# EAGLE schematic mainBoard (EAGLE 6.4)

## Sheet 1 of 6: CPU
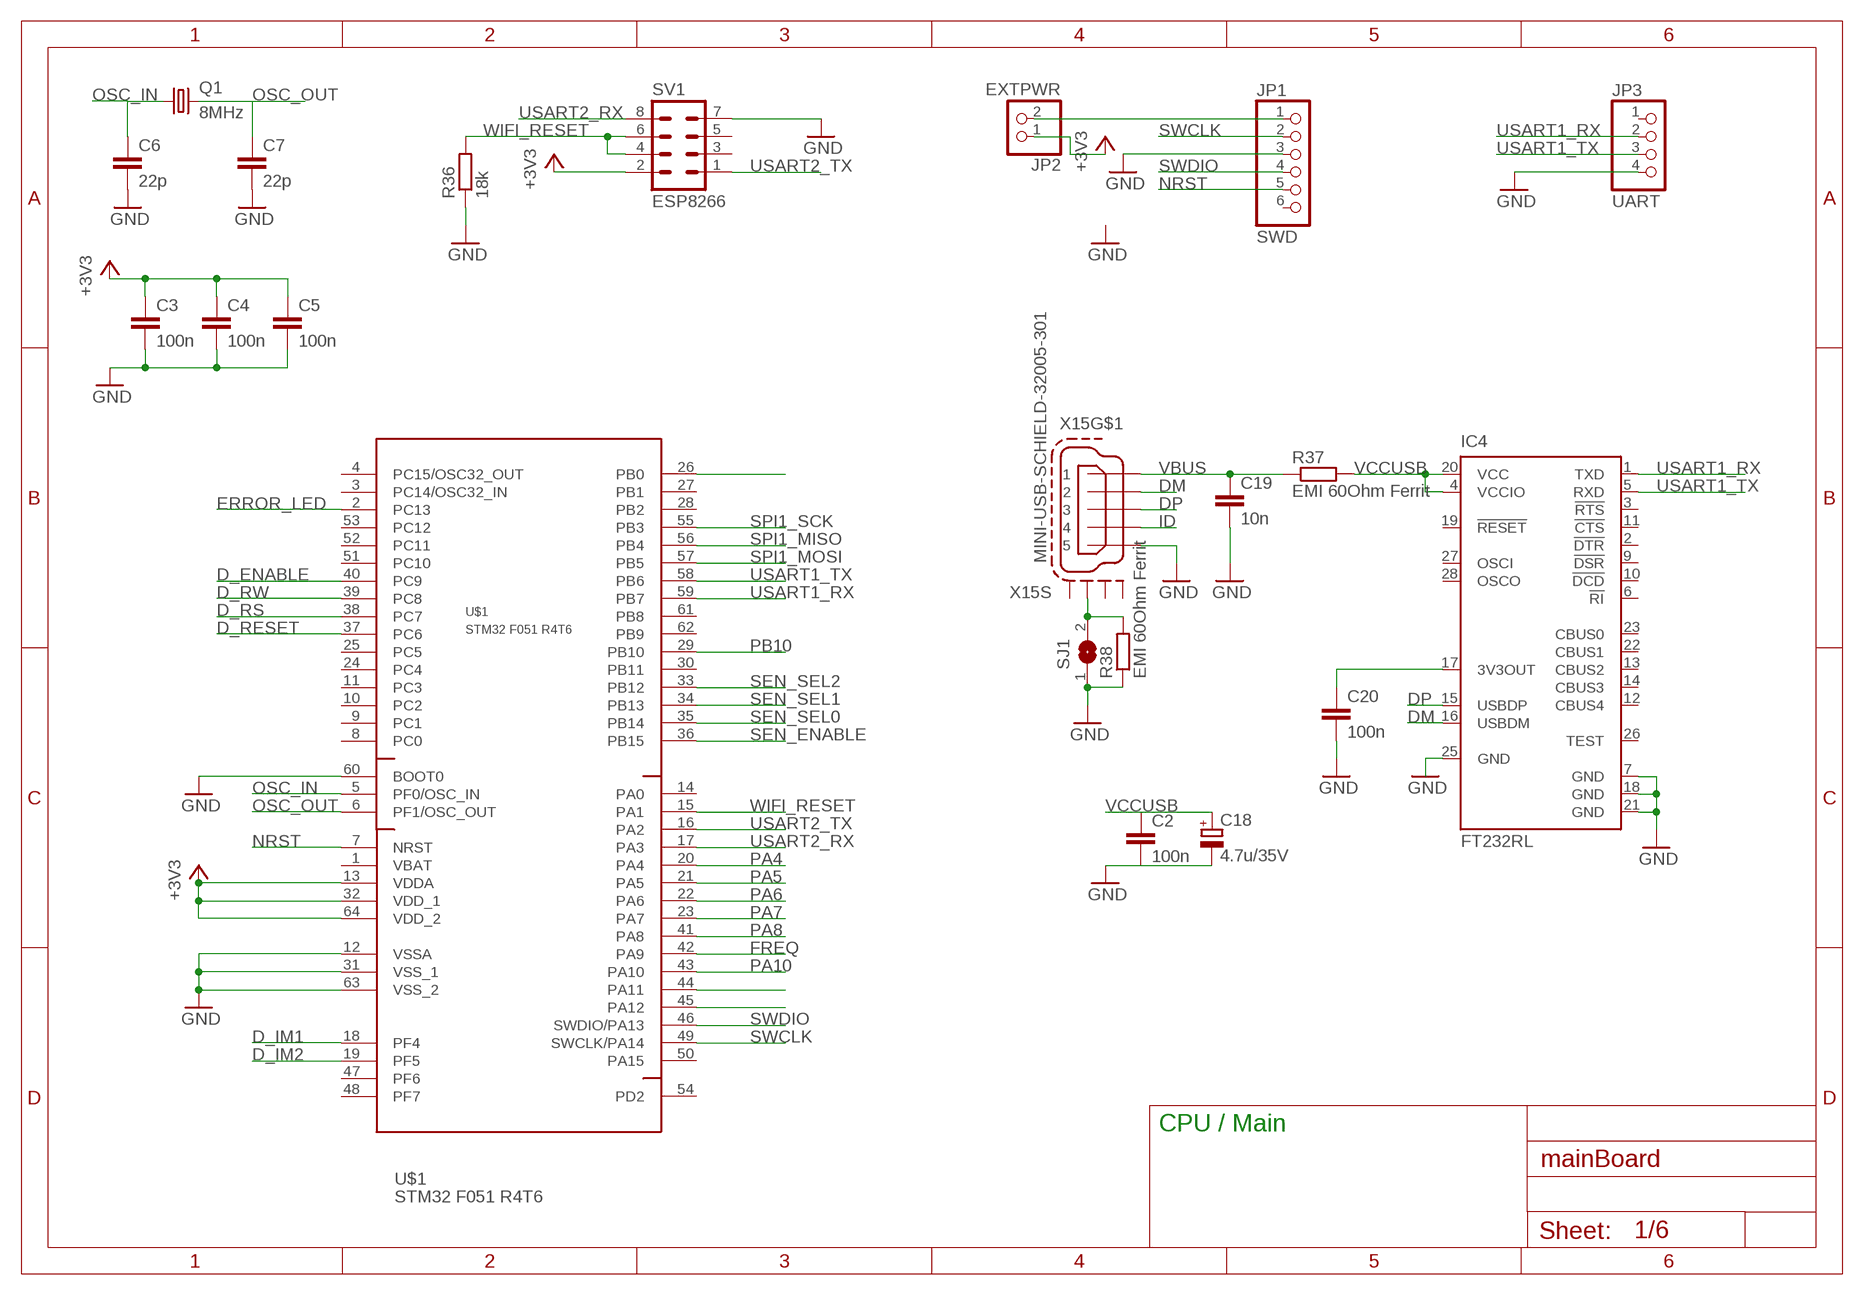
[diagram p0: schematic, sheet 1]

### Parts
C2  100n  C-EUC0603K  [C0603K]
C3  100n  C-EUC0603K  [C0603K]
C4  100n  C-EUC0603K  [C0603K]
C5  100n  C-EUC0603K  [C0603K]
C6  22p  C-EUC0805  [C0805]
C7  22p  C-EUC0805  [C0805]
C18  4.7u/35V  CPOL-EUB  [PANASONIC_B]
C19  10n  C-EUC0603K  [C0603K]
C20  100n  C-EUC0603K  [C0603K]
IC4  FT232RL  [SSOP28]
JP1  SWD  PINHD-1X6  [1X06]
JP2  EXTPWR  PINHD-1X2  [1X02]
JP3  UART  PINHD-1X4  [1X04]
Q1  8MHz  CRYSTALHC49UP  [HC49UP]
R36  18k  R-EU_R0805  [R0805]
R37  EMI 60Ohm Ferrit  R-EU_R0603  [R0603]
R38  EMI 60Ohm Ferrit  R-EU_R0603  [R0603]
SJ1  SJ  [SJ]
SV1  ESP8266  MA04-2  [MA04-2]
U$1  STM32 F051 R4T6  STM32F051  [LQFP64]
X15  MINI-USB-SCHIELD-32005-301  [32005-301]

### Nets
+3V3: C3.1 C4.1 C5.1 JP2.1 SV1.2 U$1.13(VDDA) U$1.32(VDD_1) U$1.64(VDD_2) ; also sheet 2,3,4
D_ENABLE: U$1.40(PC9) ; also sheet 4
D_IM1: U$1.18(PF4) ; also sheet 4
D_IM2: U$1.19(PF5) ; also sheet 4
D_RESET: U$1.37(PC6) ; also sheet 4
D_RS: U$1.38(PC7) ; also sheet 4
D_RW: U$1.39(PC8) ; also sheet 4
DM: IC4.16(USBDM) X15.2
DP: IC4.15(USBDP) X15.3
ERROR_LED: U$1.2(PC13) ; also sheet 4
FREQ: U$1.42(PA9) ; also sheet 3
GND: C2.2 C3.2 C4.2 C5.2 C6.2 C7.2 C18.- C19.2 C20.2 IC4.7(GND) IC4.18(GND) IC4.21(GND) IC4.25(GND) JP1.3 JP3.4 R36.1 R38.1 SJ1.1 SV1.7 U$1.12(VSSA) U$1.31(VSS_1) U$1.60(BOOT0) U$1.63(VSS_2) X15.5 ; also sheet 2,3,4,5
ID: X15.4
N$1: JP1.1 JP2.2
N$24: U$1.44(PA11)
N$25: U$1.45(PA12)
N$27: R38.2 SJ1.2 X15.M3(S:S3)
N$32: C20.1 IC4.17(3V3OUT)
NRST: JP1.5 U$1.7(NRST)
OSC_IN: C6.1 Q1.1 U$1.5(PF0/OSC_IN)
OSC_OUT: C7.1 Q1.2 U$1.6(PF1/OSC_OUT)
PA4: U$1.20(PA4) ; also sheet 5
PA5: U$1.21(PA5)
PA6: U$1.22(PA6) ; also sheet 5
PA7: U$1.23(PA7) ; also sheet 5
PA8: U$1.41(PA8) ; also sheet 5
PA10: U$1.43(PA10)
PB0: U$1.26(PB0) ; also sheet 5
PB10: U$1.29(PB10) ; also sheet 5
SEN_ENABLE: U$1.36(PB15) ; also sheet 3
SEN_SEL0: U$1.35(PB14) ; also sheet 3
SEN_SEL1: U$1.34(PB13) ; also sheet 3
SEN_SEL2: U$1.33(PB12) ; also sheet 3
SPI1_MISO: U$1.56(PB4) ; also sheet 4
SPI1_MOSI: U$1.57(PB5) ; also sheet 4
SPI1_SCK: U$1.55(PB3) ; also sheet 4
SWCLK: JP1.2 U$1.49(SWCLK/PA14)
SWDIO: JP1.4 U$1.46(SWDIO/PA13)
USART1_RX: IC4.1(TXD) JP3.2 U$1.59(PB7)
USART1_TX: IC4.5(RXD) JP3.3 U$1.58(PB6)
USART2_RX: SV1.8 U$1.17(PA3)
USART2_TX: SV1.1 U$1.16(PA2)
VBUS: C19.1 R37.1 X15.1
VCCUSB: C2.1 C18.+ IC4.4(VCCIO) IC4.20(VCC) R37.2
WIFI_RESET: R36.2 SV1.4 SV1.6 U$1.15(PA1)
Unconnected: IC4.2(!DTR) IC4.3(!RTS) IC4.6(!RI) IC4.9(!DSR) IC4.10(!DCD) IC4.11(!CTS) IC4.12(CBUS4) IC4.13(CBUS2) IC4.14(CBUS3) IC4.19(!RESET) IC4.22(CBUS1) IC4.23(CBUS0) IC4.26(TEST) IC4.27(OSCI) IC4.28(OSCO) JP1.6 JP3.1 SV1.3 SV1.5 U$1.3(PC14/OSC32_IN) U$1.4(PC15/OSC32_OUT) U$1.8(PC0) U$1.9(PC1) U$1.10(PC2) U$1.11(PC3) U$1.14(PA0) U$1.24(PC4) U$1.25(PC5) U$1.27(PB1) U$1.28(PB2) U$1.30(PB11) U$1.47(PF6) U$1.48(PF7) U$1.50(PA15) U$1.51(PC10) U$1.52(PC11) U$1.53(PC12) U$1.54(PD2) U$1.61(PB8) U$1.62(PB9) X15.M1(S:S1) X15.M2(S:S2) X15.M4(S:S4)

### Notes on the sheet
- CPU / Main

## Sheet 2 of 6: PowerSupply
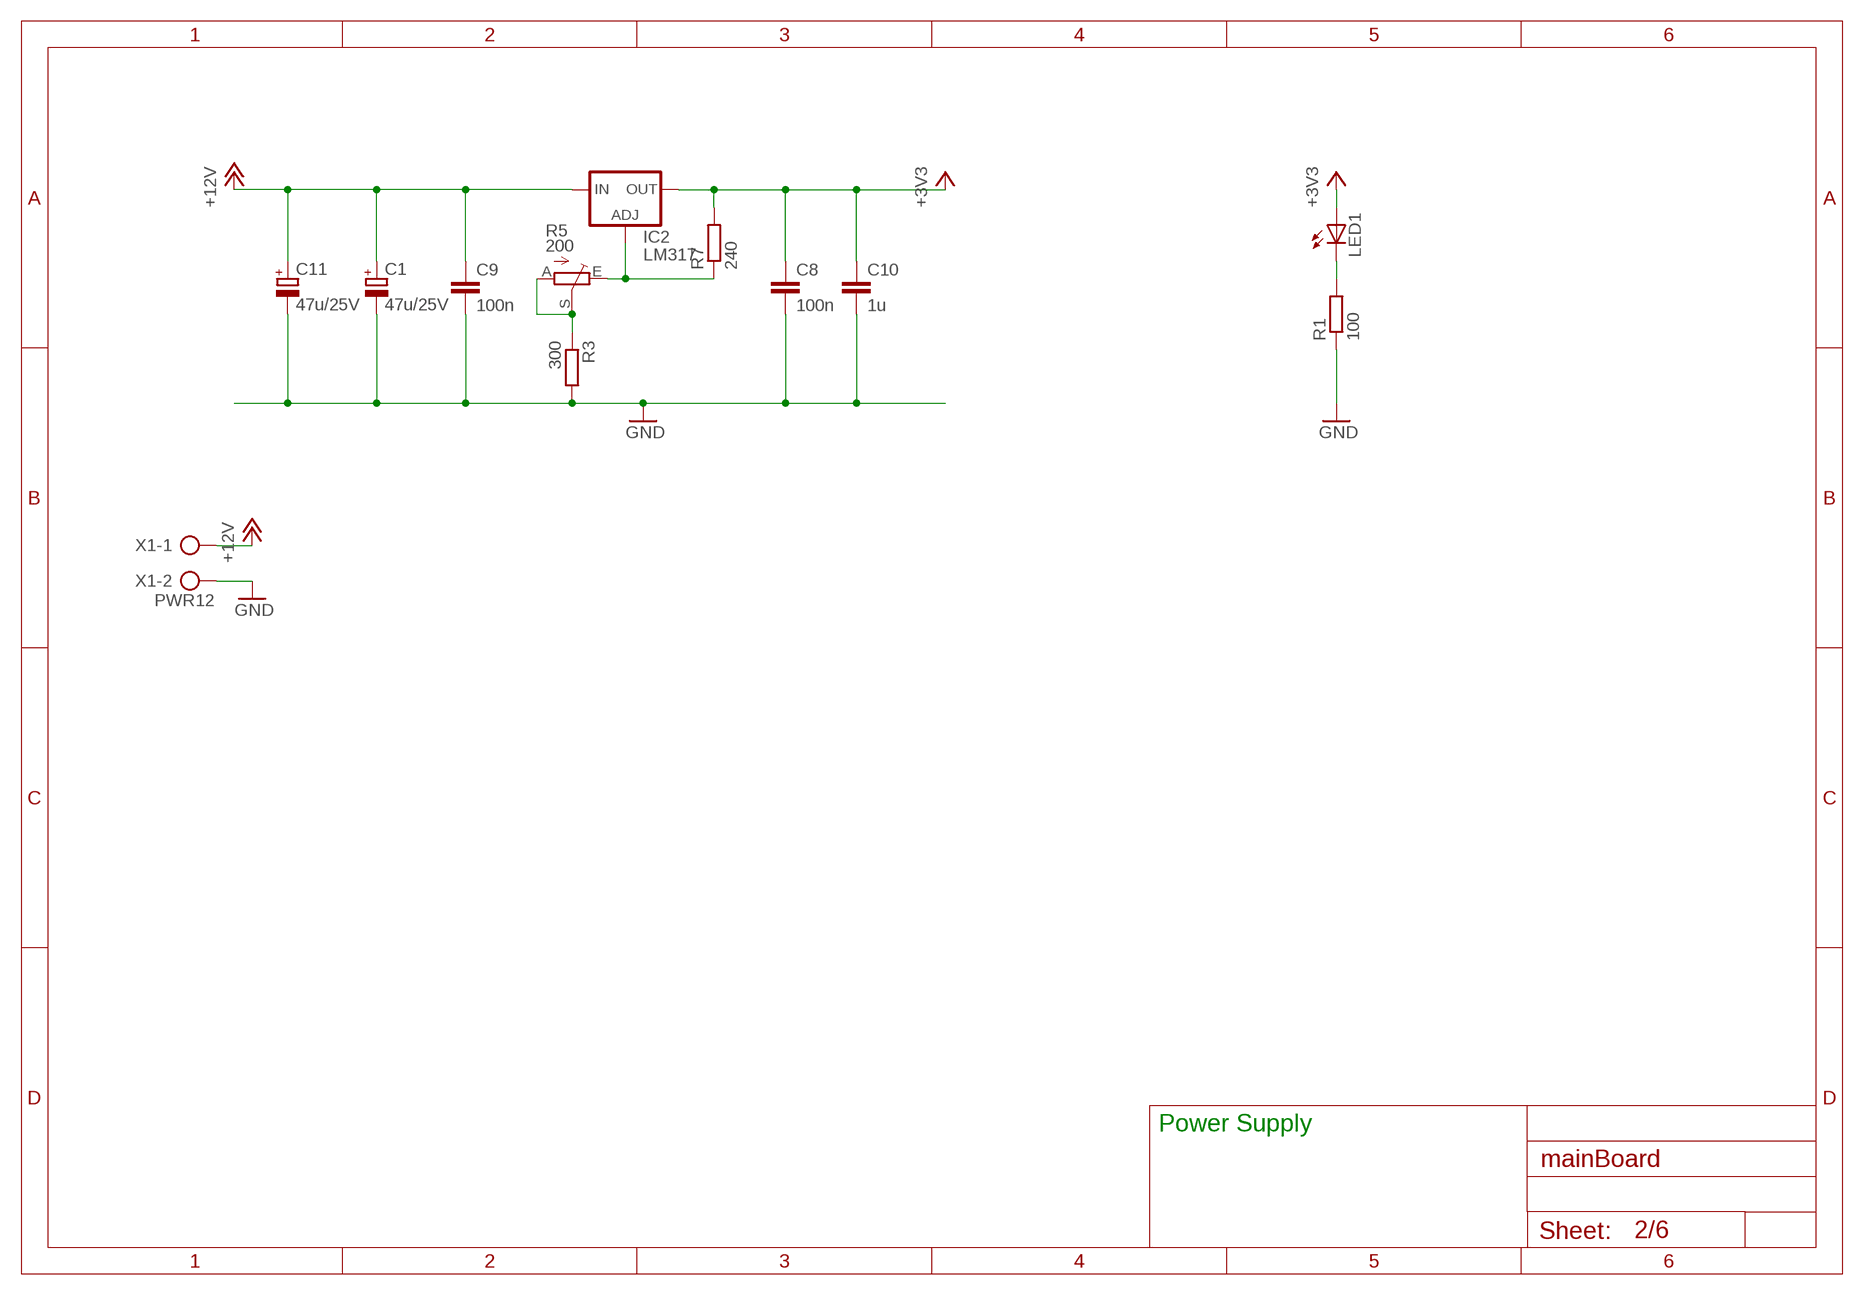
[diagram p1: schematic, sheet 2]

### Parts
C1  47u/25V  CPOL-EUD  [PANASONIC_D]
C8  100n  C-EUC0805  [C0805]
C9  100n  C-EUC0805  [C0805]
C10  1u  C-EUC0805  [C0805]
C11  47u/25V  CPOL-EUD  [PANASONIC_D]
IC2  LM317  LM317MBSTT3  [SOT223]
LED1  LEDCHIP-LED0805  [CHIP-LED0805]
R1  100  R-EU_R0805  [R0805]
R3  300  R-EU_R0805  [R0805]
R5  200  TRIM_EU-S64Y  [S64Y]
R7  240  R-EU_R0805  [R0805]
X1  PWR12  AK500/2  [AK500/2]

### Nets
+3V3: C8.1 C10.1 IC2.4(OUT) LED1.A R7.2 ; also sheet 1,3,4
+12V: C1.+ C9.1 C11.+ IC2.3(IN) X1.1 ; also sheet 5
GND: C1.- C8.2 C9.2 C10.2 C11.- R1.1 R3.2 X1.2 ; also sheet 1,3,4,5
N$9: LED1.C R1.2
N$12: R3.1 R5.A R5.S
N$20: IC2.1(ADJ) R5.E R7.1

### Notes on the sheet
- Power Supply

## Sheet 3 of 6: Sensors
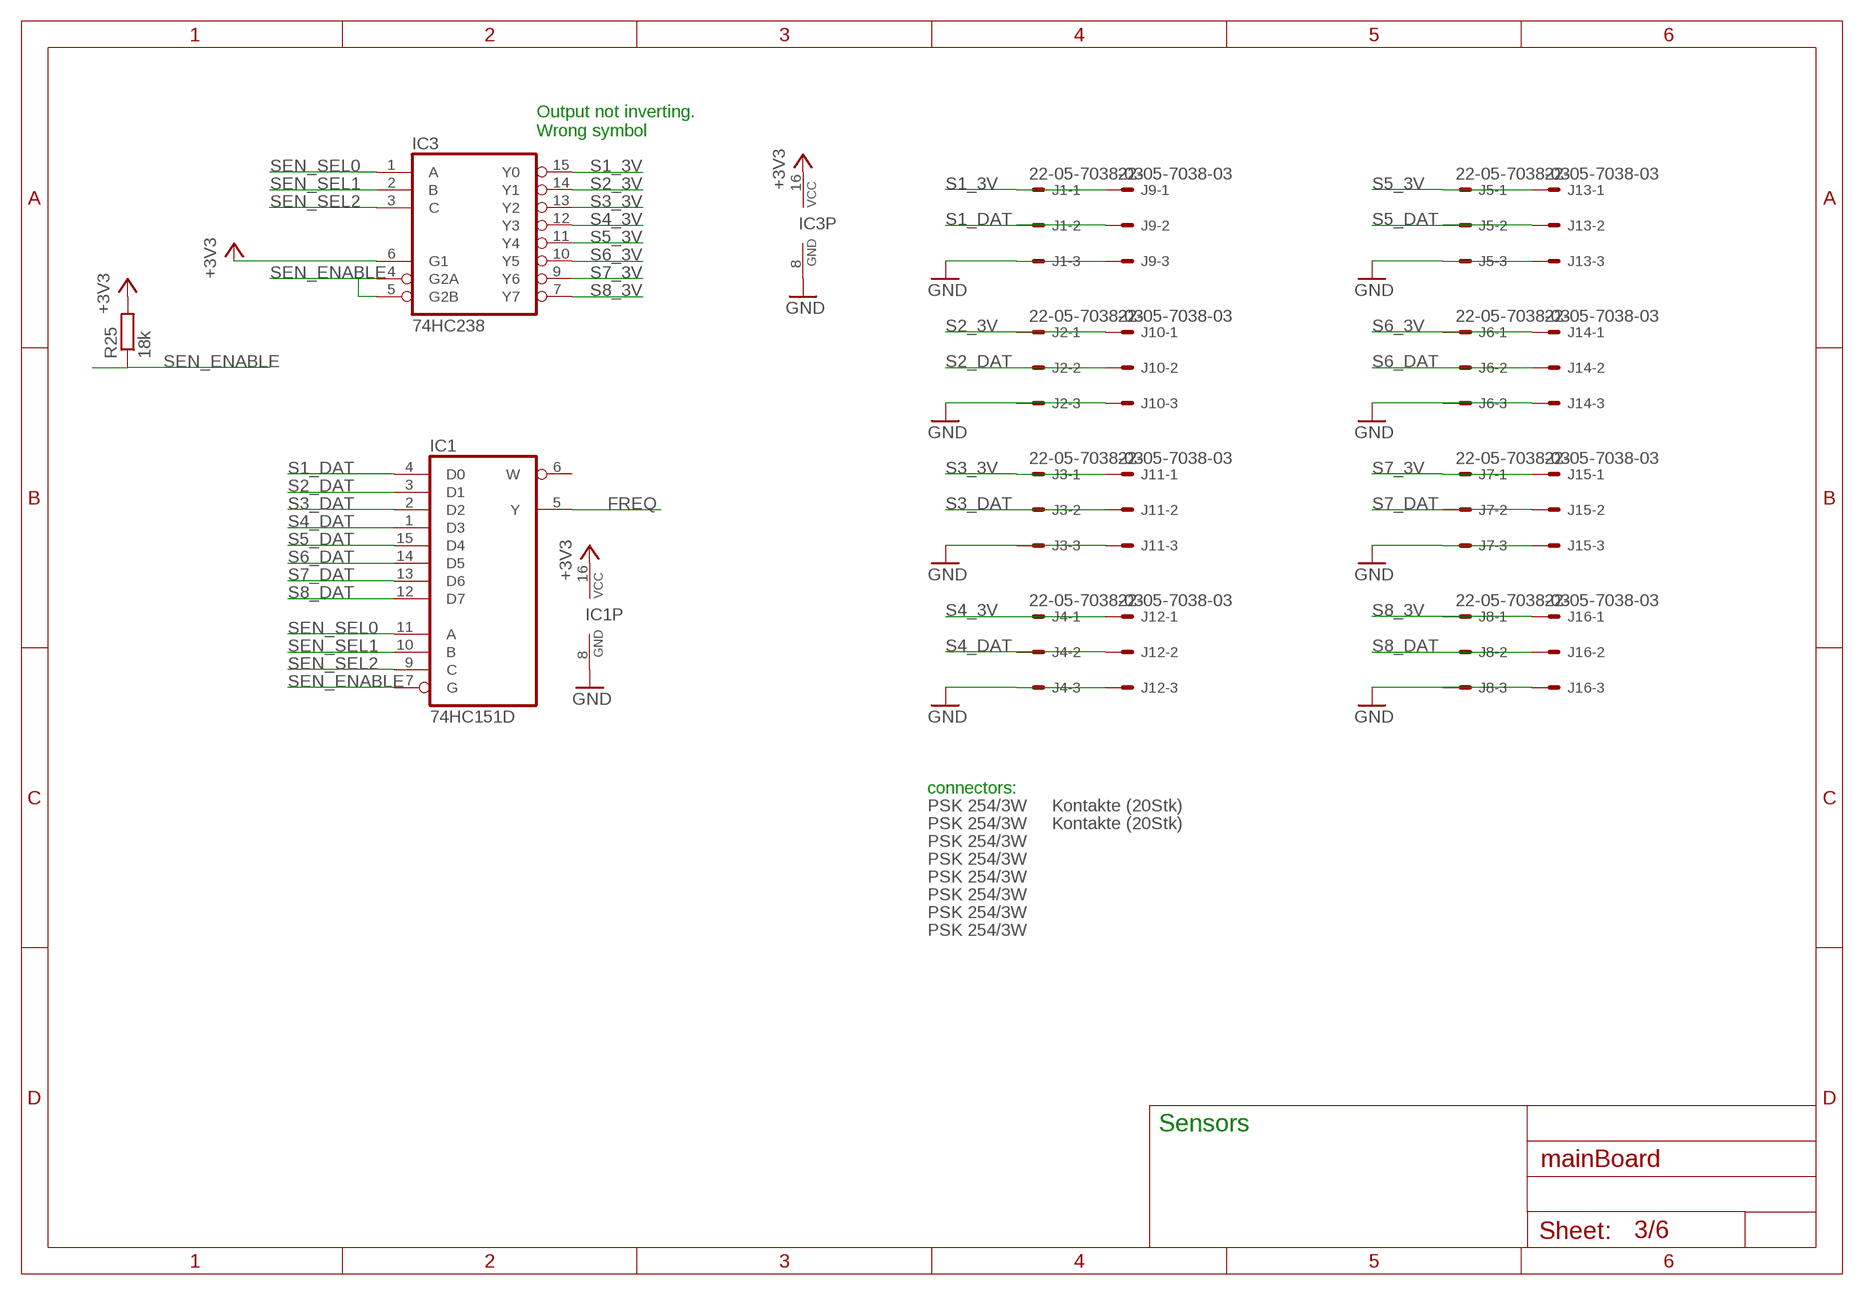
[diagram p2: schematic, sheet 3]

### Parts
IC1  74HC151D  [SO16]
IC3  74HC238  74HC138D  [SO16]
J1  22-05-7038-03  [7395-03]
J2  22-05-7038-03  [7395-03]
J3  22-05-7038-03  [7395-03]
J4  22-05-7038-03  [7395-03]
J5  22-05-7038-03  [7395-03]
J6  22-05-7038-03  [7395-03]
J7  22-05-7038-03  [7395-03]
J8  22-05-7038-03  [7395-03]
J9  22-05-7038-03  [7395-03]
J10  22-05-7038-03  [7395-03]
J11  22-05-7038-03  [7395-03]
J12  22-05-7038-03  [7395-03]
J13  22-05-7038-03  [7395-03]
J14  22-05-7038-03  [7395-03]
J15  22-05-7038-03  [7395-03]
J16  22-05-7038-03  [7395-03]
R25  18k  R-EU_R0805  [R0805]
U$3  PSK 254/3W  DUMMY_BOM  [DUMMY_BOM]
U$4  PSK 254/3W  DUMMY_BOM  [DUMMY_BOM]
U$5  PSK 254/3W  DUMMY_BOM  [DUMMY_BOM]
U$6  PSK 254/3W  DUMMY_BOM  [DUMMY_BOM]
U$7  PSK 254/3W  DUMMY_BOM  [DUMMY_BOM]
U$8  PSK 254/3W  DUMMY_BOM  [DUMMY_BOM]
U$9  PSK 254/3W  DUMMY_BOM  [DUMMY_BOM]
U$10  PSK 254/3W  DUMMY_BOM  [DUMMY_BOM]
U$18  Kontakte (20Stk)  DUMMY_BOM  [DUMMY_BOM]
U$19  Kontakte (20Stk)  DUMMY_BOM  [DUMMY_BOM]

### Nets
+3V3: IC1.16(VCC) IC3.6(G1) IC3.16(VCC) R25.2 ; also sheet 1,2,4
FREQ: IC1.5(Y) ; also sheet 1
GND: IC1.8(GND) IC3.8(GND) J1.3 J2.3 J3.3 J4.3 J5.3 J6.3 J7.3 J8.3 J9.3 J10.3 J11.3 J12.3 J13.3 J14.3 J15.3 J16.3 ; also sheet 1,2,4,5
S1_3V: IC3.15(Y0) J1.1 J9.1
S1_DAT: IC1.4(D0) J1.2 J9.2
S2_3V: IC3.14(Y1) J2.1 J10.1
S2_DAT: IC1.3(D1) J2.2 J10.2
S3_3V: IC3.13(Y2) J3.1 J11.1
S3_DAT: IC1.2(D2) J3.2 J11.2
S4_3V: IC3.12(Y3) J4.1 J12.1
S4_DAT: IC1.1(D3) J4.2 J12.2
S5_3V: IC3.11(Y4) J5.1 J13.1
S5_DAT: IC1.15(D4) J5.2 J13.2
S6_3V: IC3.10(Y5) J6.1 J14.1
S6_DAT: IC1.14(D5) J6.2 J14.2
S7_3V: IC3.9(Y6) J7.1 J15.1
S7_DAT: IC1.13(D6) J7.2 J15.2
S8_3V: IC3.7(Y7) J8.1 J16.1
S8_DAT: IC1.12(D7) J8.2 J16.2
SEN_ENABLE: IC1.7(G) IC3.4(G2A) IC3.5(G2B) R25.1 ; also sheet 1
SEN_SEL0: IC1.11(A) IC3.1(A) ; also sheet 1
SEN_SEL1: IC1.10(B) IC3.2(B) ; also sheet 1
SEN_SEL2: IC1.9(C) IC3.3(C) ; also sheet 1
Unconnected: IC1.6(W)

### Notes on the sheet
- Output not inverting.
  Wrong symbol
- connectors:
- Sensors

## Sheet 4 of 6: UserInterface
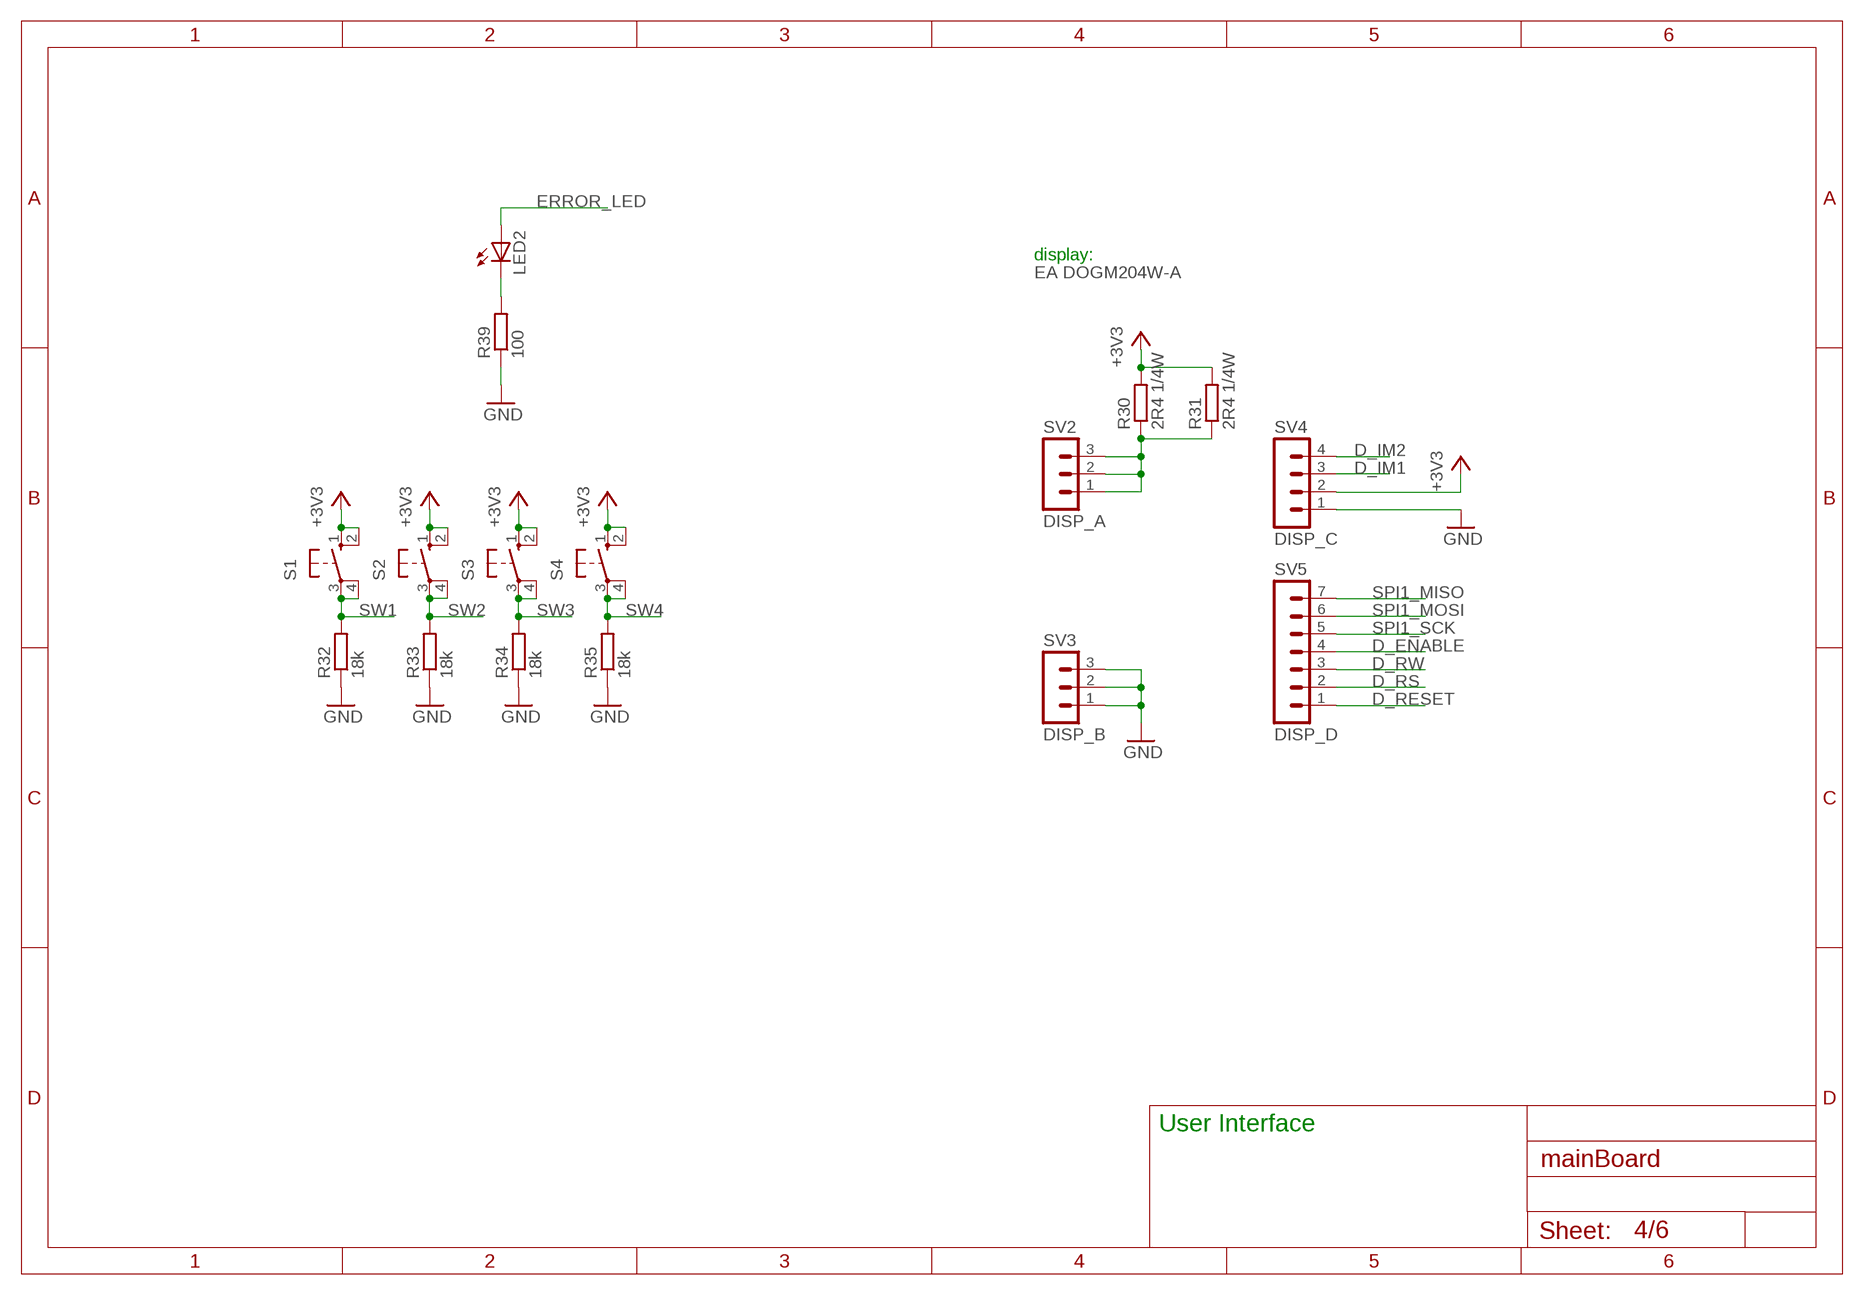
[diagram p3: schematic, sheet 4]

### Parts
LED2  LED3MM  [LED3MM]
R30  2R4 1/4W  R-EU_R1206  [R1206]
R31  2R4 1/4W  R-EU_R1206  [R1206]
R32  18k  R-EU_R0805  [R0805]
R33  18k  R-EU_R0805  [R0805]
R34  18k  R-EU_R0805  [R0805]
R35  18k  R-EU_R0805  [R0805]
R39  100  R-EU_R0805  [R0805]
S1  10-XX  [B3F-10XX]
S2  10-XX  [B3F-10XX]
S3  10-XX  [B3F-10XX]
S4  10-XX  [B3F-10XX]
SV2  DISP_A  MA03-1  [MA03-1]
SV3  DISP_B  MA03-1  [MA03-1]
SV4  DISP_C  MA04-1  [MA04-1]
SV5  DISP_D  MA07-1  [MA07-1]
U$11  EA DOGM204W-A  DUMMY_BOM  [DUMMY_BOM]

### Nets
+3V3: R30.2 R31.2 S1.1(S) S1.2(S1) S2.1(S) S2.2(S1) S3.1(S) S3.2(S1) S4.1(S) S4.2(S1) SV4.2 ; also sheet 1,2,3
D_ENABLE: SV5.4 ; also sheet 1
D_IM1: SV4.3 ; also sheet 1
D_IM2: SV4.4 ; also sheet 1
D_RESET: SV5.1 ; also sheet 1
D_RS: SV5.2 ; also sheet 1
D_RW: SV5.3 ; also sheet 1
ERROR_LED: LED2.A ; also sheet 1
GND: R32.1 R33.1 R34.1 R35.1 R39.1 SV3.1 SV3.2 SV3.3 SV4.1 ; also sheet 1,2,3,5
N$23: R30.1 R31.1 SV2.1 SV2.2 SV2.3
N$29: LED2.K(C) R39.2
SPI1_MISO: SV5.7 ; also sheet 1
SPI1_MOSI: SV5.6 ; also sheet 1
SPI1_SCK: SV5.5 ; also sheet 1
SW1: R32.2 S1.3(P) S1.4(P1)
SW2: R33.2 S2.3(P) S2.4(P1)
SW3: R34.2 S3.3(P) S3.4(P1)
SW4: R35.2 S4.3(P) S4.4(P1)

### Notes on the sheet
- display:
- User Interface

## Sheet 5 of 6: Pumps
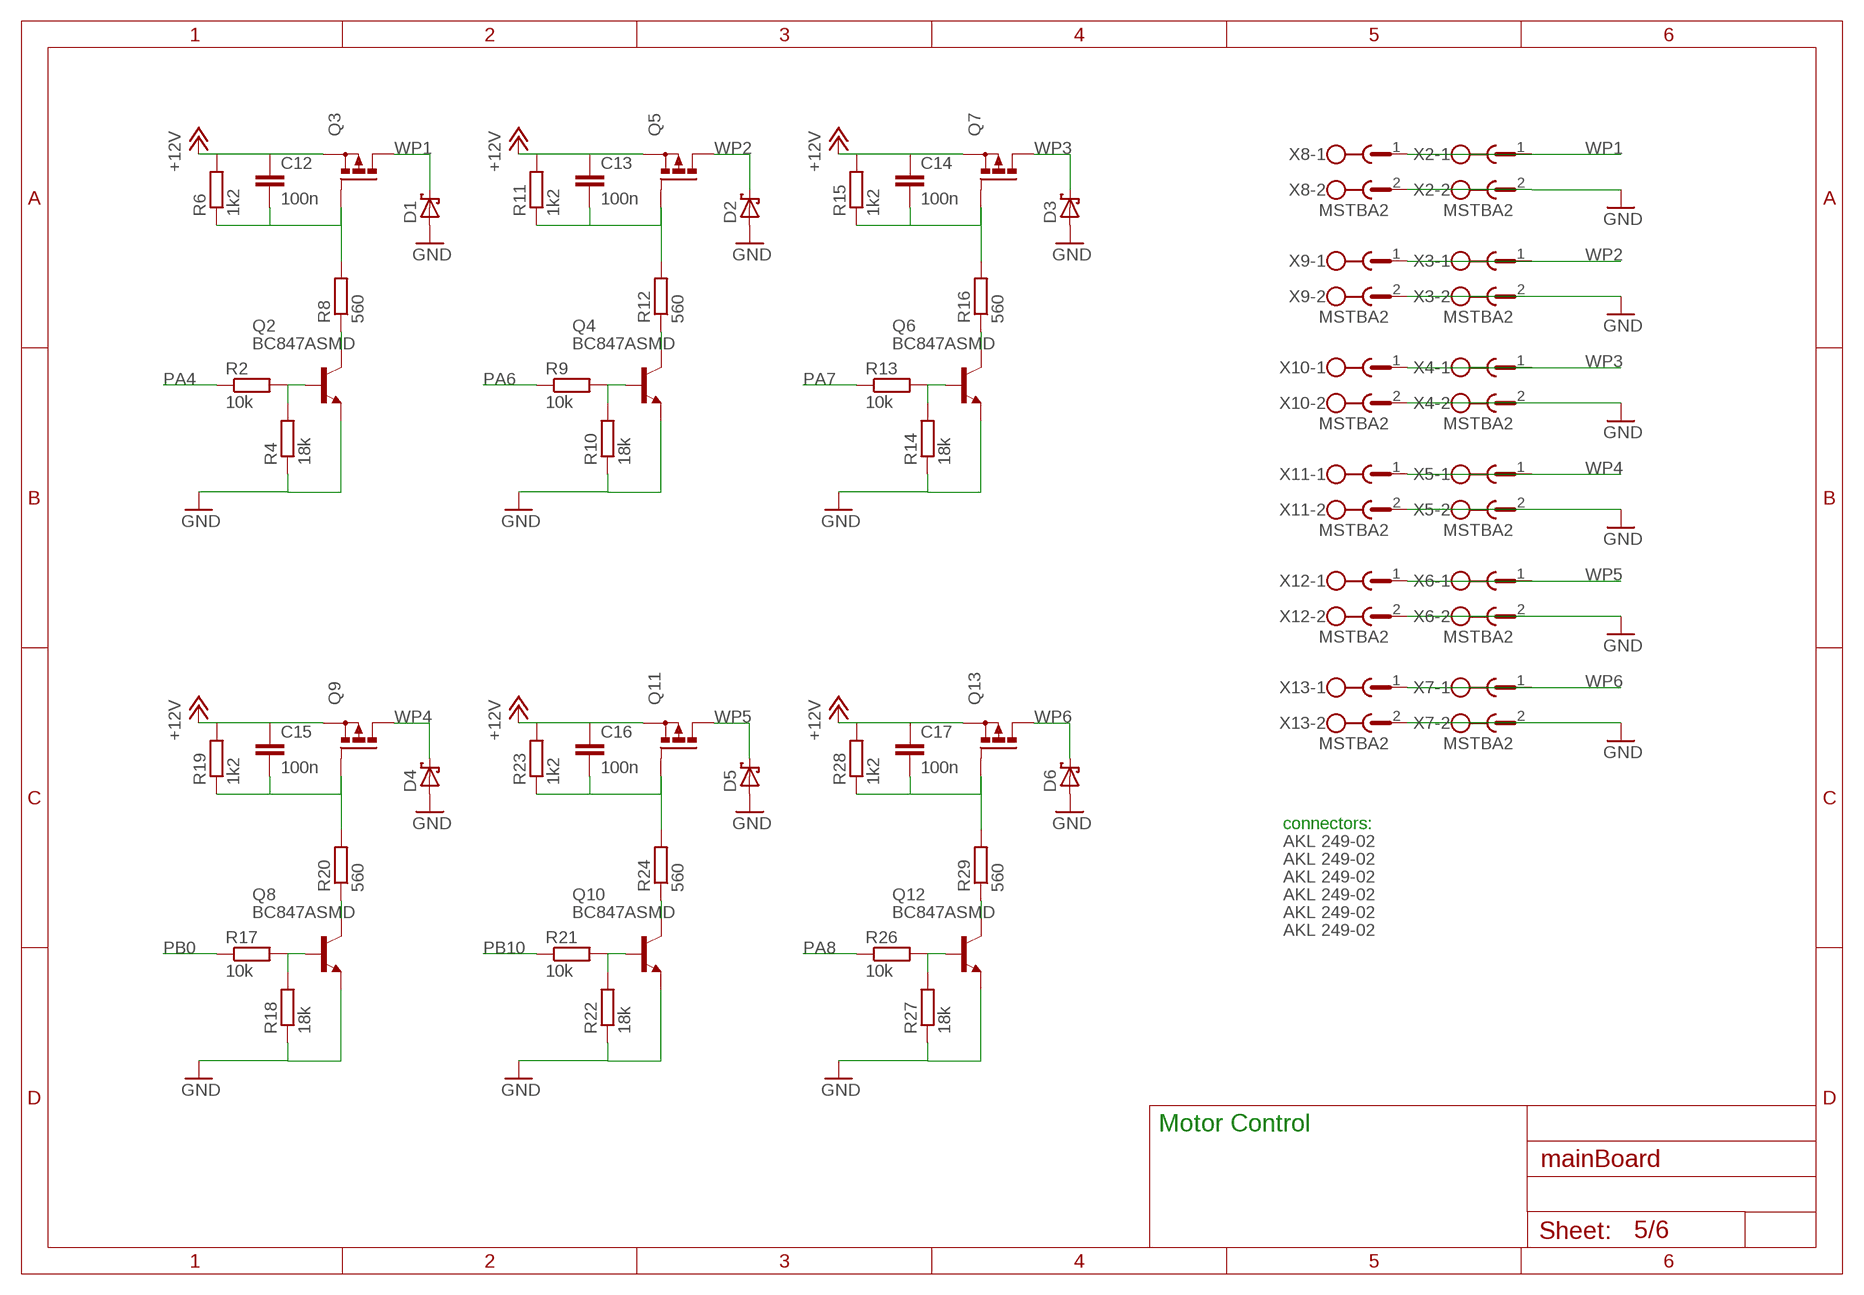
[diagram p4: schematic, sheet 5]

### Parts
C12  100n  C-EUC0805  [C0805]
C13  100n  C-EUC0805  [C0805]
C14  100n  C-EUC0805  [C0805]
C15  100n  C-EUC0805  [C0805]
C16  100n  C-EUC0805  [C0805]
C17  100n  C-EUC0805  [C0805]
D1  SCHOTTKY-DIODESMC  [SMC]
D2  SCHOTTKY-DIODESMC  [SMC]
D3  SCHOTTKY-DIODESMC  [SMC]
D4  SCHOTTKY-DIODESMC  [SMC]
D5  SCHOTTKY-DIODESMC  [SMC]
D6  SCHOTTKY-DIODESMC  [SMC]
Q2  BC847ASMD  [SOT23]
Q3  P-MOSFET-SO8  [SO-08]
Q4  BC847ASMD  [SOT23]
Q5  P-MOSFET-SO8  [SO-08]
Q6  BC847ASMD  [SOT23]
Q7  P-MOSFET-SO8  [SO-08]
Q8  BC847ASMD  [SOT23]
Q9  P-MOSFET-SO8  [SO-08]
Q10  BC847ASMD  [SOT23]
Q11  P-MOSFET-SO8  [SO-08]
Q12  BC847ASMD  [SOT23]
Q13  P-MOSFET-SO8  [SO-08]
R2  10k  R-EU_R0805  [R0805]
R4  18k  R-EU_R0805  [R0805]
R6  1k2  R-EU_R0805  [R0805]
R8  560  R-EU_R0805  [R0805]
R9  10k  R-EU_R0805  [R0805]
R10  18k  R-EU_R0805  [R0805]
R11  1k2  R-EU_R0805  [R0805]
R12  560  R-EU_R0805  [R0805]
R13  10k  R-EU_R0805  [R0805]
R14  18k  R-EU_R0805  [R0805]
R15  1k2  R-EU_R0805  [R0805]
R16  560  R-EU_R0805  [R0805]
R17  10k  R-EU_R0805  [R0805]
R18  18k  R-EU_R0805  [R0805]
R19  1k2  R-EU_R0805  [R0805]
R20  560  R-EU_R0805  [R0805]
R21  10k  R-EU_R0805  [R0805]
R22  18k  R-EU_R0805  [R0805]
R23  1k2  R-EU_R0805  [R0805]
R24  560  R-EU_R0805  [R0805]
R26  10k  R-EU_R0805  [R0805]
R27  18k  R-EU_R0805  [R0805]
R28  1k2  R-EU_R0805  [R0805]
R29  560  R-EU_R0805  [R0805]
U$12  AKL 249-02  DUMMY_BOM  [DUMMY_BOM]
U$13  AKL 249-02  DUMMY_BOM  [DUMMY_BOM]
U$14  AKL 249-02  DUMMY_BOM  [DUMMY_BOM]
U$15  AKL 249-02  DUMMY_BOM  [DUMMY_BOM]
U$16  AKL 249-02  DUMMY_BOM  [DUMMY_BOM]
U$17  AKL 249-02  DUMMY_BOM  [DUMMY_BOM]
X2  MSTBA2  [MSTBA2]
X3  MSTBA2  [MSTBA2]
X4  MSTBA2  [MSTBA2]
X5  MSTBA2  [MSTBA2]
X6  MSTBA2  [MSTBA2]
X7  MSTBA2  [MSTBA2]
X8  MSTBA2  [MSTBA2]
X9  MSTBA2  [MSTBA2]
X10  MSTBA2  [MSTBA2]
X11  MSTBA2  [MSTBA2]
X12  MSTBA2  [MSTBA2]
X13  MSTBA2  [MSTBA2]

### Nets
+12V: C12.1 C13.1 C14.1 C15.1 C16.1 C17.1 Q3.1(S) Q3.2(S) Q3.3(S) Q5.1(S) Q5.2(S) Q5.3(S) Q7.1(S) Q7.2(S) Q7.3(S) Q9.1(S) Q9.2(S) Q9.3(S) Q11.1(S) Q11.2(S) Q11.3(S) Q13.1(S) Q13.2(S) Q13.3(S) R6.2 R11.2 R15.2 R19.2 R23.2 R28.2 ; also sheet 2
GND: D1.A D2.A D3.A D4.A D5.A D6.A Q2.2(E) Q4.2(E) Q6.2(E) Q8.2(E) Q10.2(E) Q12.2(E) R4.1 R10.1 R14.1 R18.1 R22.1 R27.1 X2.2 X3.2 X4.2 X5.2 X6.2 X7.2 X8.2 X9.2 X10.2 X11.2 X12.2 X13.2 ; also sheet 1,2,3,4
N$2: C13.2 Q5.4(G) R11.1 R12.2
N$3: C12.2 Q3.4(G) R6.1 R8.2
N$4: Q2.3(C) R8.1
N$5: Q2.1(B) R2.2 R4.2
N$6: Q4.3(C) R12.1
N$7: Q4.1(B) R9.2 R10.2
N$8: C14.2 Q7.4(G) R15.1 R16.2
N$10: Q6.3(C) R16.1
N$11: Q6.1(B) R13.2 R14.2
N$13: C15.2 Q9.4(G) R19.1 R20.2
N$14: Q8.3(C) R20.1
N$15: Q8.1(B) R17.2 R18.2
N$16: C16.2 Q11.4(G) R23.1 R24.2
N$17: Q10.3(C) R24.1
N$18: Q10.1(B) R21.2 R22.2
N$19: C17.2 Q13.4(G) R28.1 R29.2
N$21: Q12.3(C) R29.1
N$22: Q12.1(B) R26.2 R27.2
PA4: R2.1 ; also sheet 1
PA6: R9.1 ; also sheet 1
PA7: R13.1 ; also sheet 1
PA8: R26.1 ; also sheet 1
PB0: R17.1 ; also sheet 1
PB10: R21.1 ; also sheet 1
WP1: D1.C Q3.5(D) Q3.6(D) Q3.7(D) Q3.8(D) X2.1 X8.1
WP2: D2.C Q5.5(D) Q5.6(D) Q5.7(D) Q5.8(D) X3.1 X9.1
WP3: D3.C Q7.5(D) Q7.6(D) Q7.7(D) Q7.8(D) X4.1 X10.1
WP4: D4.C Q9.5(D) Q9.6(D) Q9.7(D) Q9.8(D) X5.1 X11.1
WP5: D5.C Q11.5(D) Q11.6(D) Q11.7(D) Q11.8(D) X6.1 X12.1
WP6: D6.C Q13.5(D) Q13.6(D) Q13.7(D) Q13.8(D) X7.1 X13.1

### Notes on the sheet
- connectors:
- Motor Control

## Sheet 6 of 6: OtherThings
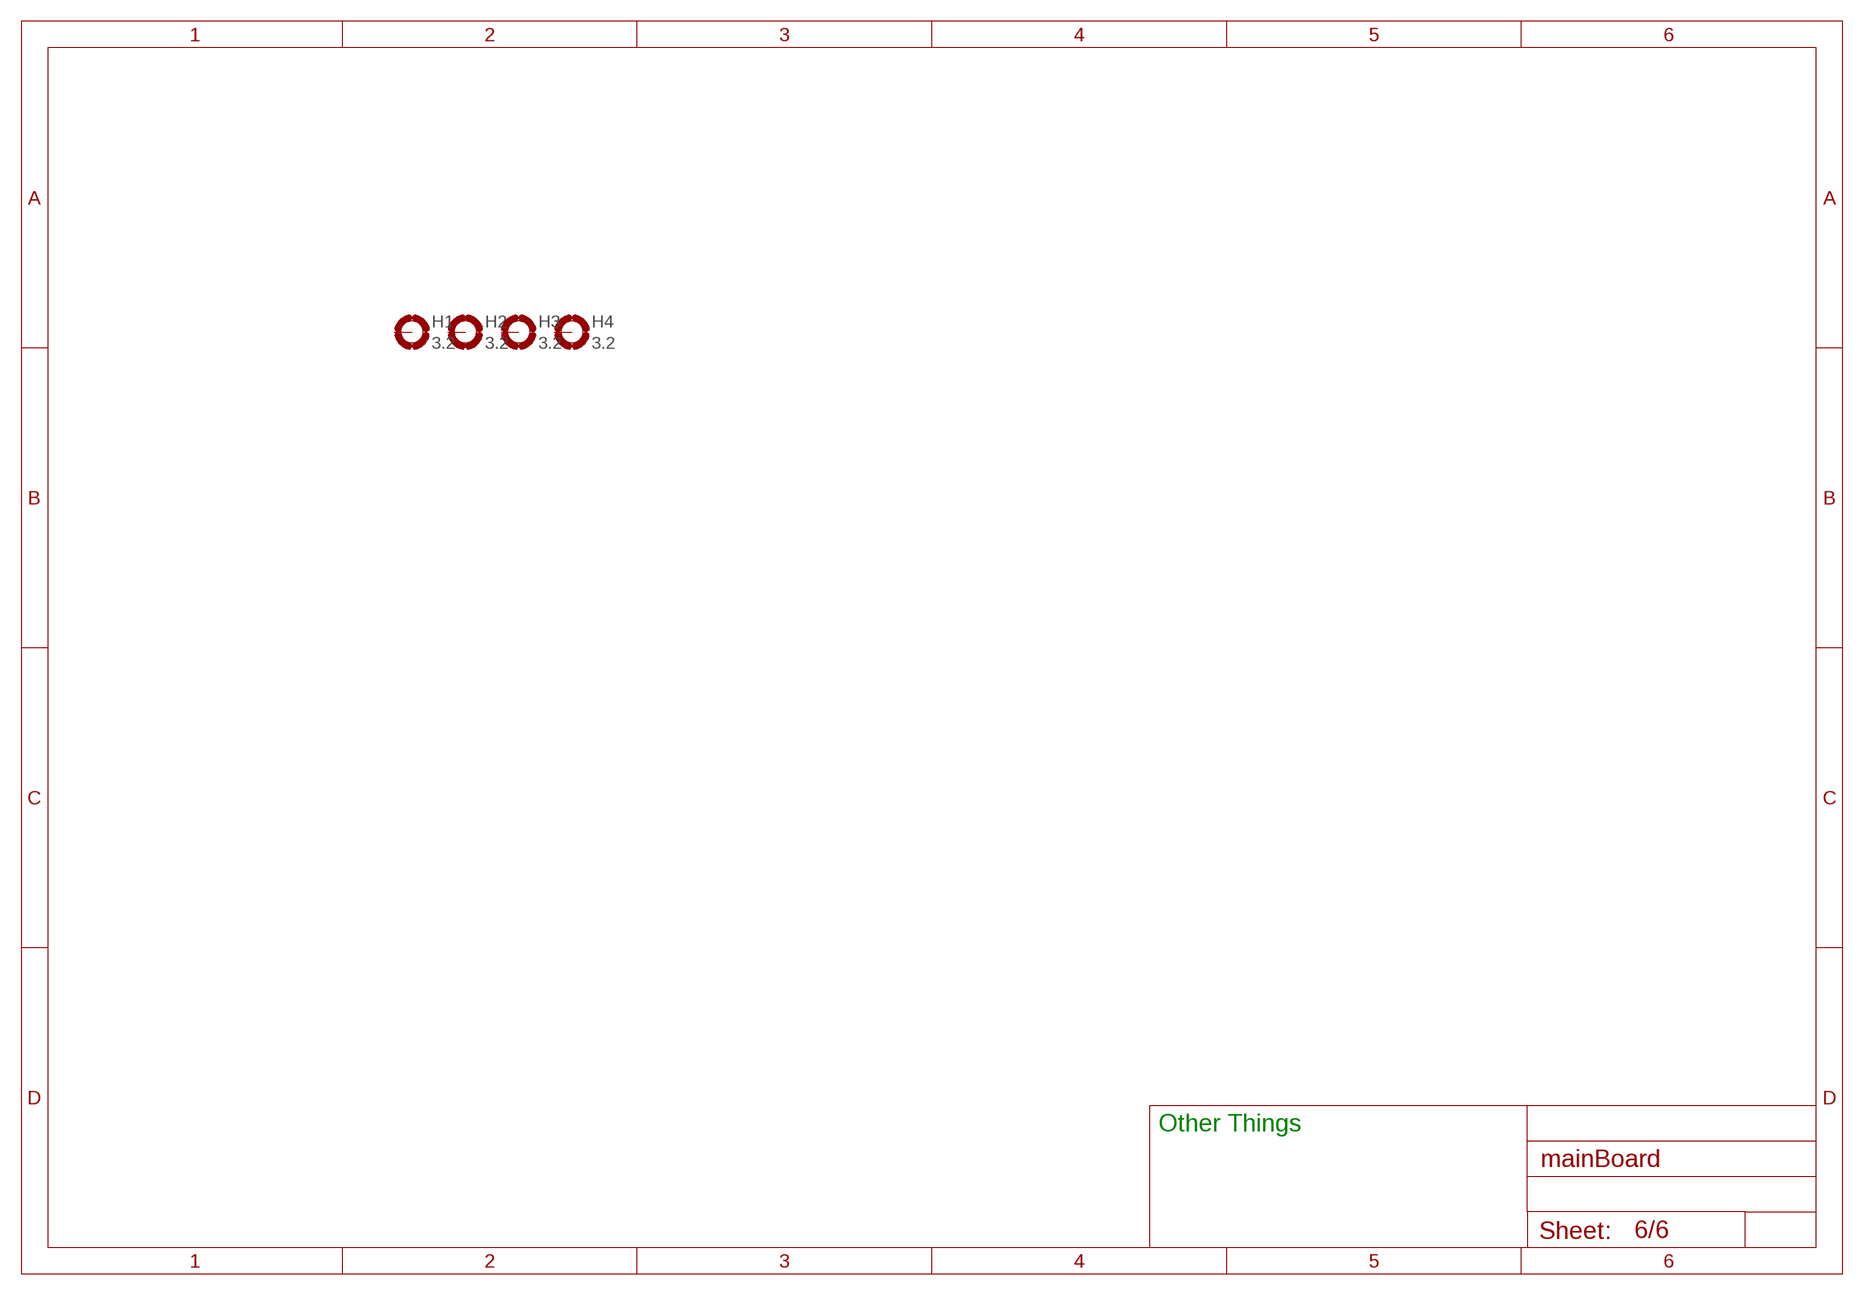
[diagram p5: schematic, sheet 6]

### Parts
H1  3.2  MOUNT-PAD-ROUND3.2  [3,2-PAD]
H2  3.2  MOUNT-PAD-ROUND3.2  [3,2-PAD]
H3  3.2  MOUNT-PAD-ROUND3.2  [3,2-PAD]
H4  3.2  MOUNT-PAD-ROUND3.2  [3,2-PAD]
Unconnected: H1.B3,2(MOUNT) H2.B3,2(MOUNT) H3.B3,2(MOUNT) H4.B3,2(MOUNT)

### Notes on the sheet
- Other Things

## Power pins joined to a net without a drawn wire
VBAT: U$1.1(VBAT)

## Library data of the parts
C1 C11 = rcl:CPOL-EU: POLARIZED CAPACITOR, European symbol; R: VF 47/25 P-D
C2-C5 C20 = rcl:C-EU: CAPACITOR, European symbol; R: X7R-G0603 100N
C6 C7 = rcl:C-EU: CAPACITOR, European symbol; R: NPO-G0805 22P
C8 C9 C12-C17 = rcl:C-EU: CAPACITOR, European symbol; R: X7R-G0805 100N
C10 = rcl:C-EU: CAPACITOR, European symbol; R: X7R-G0805 1,0/25
C18 = rcl:CPOL-EU: POLARIZED CAPACITOR, European symbol; R: SMD ELKO 4,7/35
C19 = rcl:C-EU: CAPACITOR, European symbol; R: X7R-G0603 10N
D1-D6 = diode:SCHOTTKY-DIODE: Schottky Diode; R: B 340 F
H1-H4 = holes:MOUNT-PAD-ROUND: MOUNTING PAD, round
IC1 = 74xx-eu:74*151: Data SELECTOR/MULTIPLEXER; R: SMD HC 151
IC2 = v-reg:LM317?*: 500 mA Adjustable Output Positive Voltage Regulator Source: http://www.onsemi.co.jp .. LM317M-D.PDF; R: LM317EMP
IC3 = 74xx-eu:74*138: 3-line to 8-line DECODER/DEMULTIPLEXER; R: SMD HC 238
IC4 = ftdichip:FT232R: Source: http://www.ftdichip.com/Documents/DataSheets/DS_FT232R_v104.pdf; MPN: FT232RL; OC_FARNELL: 1146032; OC_NEWARK: 91K9918; R: FT 232 RL
J1-J8 = con-molex:22-?-03: CONNECTOR wire to board 2.54 mm (.1 inch) pitch header; OC_FARNELL: unknown; OC_NEWARK: unknown; R: PSS 254/3W
J9-J16 = con-molex:22-?-03: CONNECTOR wire to board 2.54 mm (.1 inch) pitch header; OC_FARNELL: unknown; OC_NEWARK: unknown
JP1 = pinhead:PINHD-1X6: PIN HEADER; R: MPE 087-1-006
JP2 = pinhead:PINHD-1X2: PIN HEADER; R: MPE 087-1-002
JP3 = pinhead:PINHD-1X4: PIN HEADER; R: MPE 087-1-004
LED1 = led:LED: LED OSRAM: - CHIPLED LG R971, LG N971, LY N971, LG Q971, LY Q971, LO R971, LY R971 LH N974, LH R974 LS Q976, LO Q976, LY Q976 LO Q996 - Hyper CHIPLED LW Q18S LB Q993, LB Q99A, LB R99A - SideLED LS A670, LO A670, LY A670, LG A670, LP A670 LB A673, LV A673, LT A673, LW A673 LH A674 LY A675 LS A676, LA A676, LO A676, LY A676, LW A676 LS A679, LY A679, LG A679 - Hyper Micro SIDELED® LS Y876, LA Y876, LO Y876, LY Y876 LT Y87S - SmartLED LW L88C, LW L88S LB L89C, LB L89S, LG L890 LS L89K, LO L89K, LY L89K LS L896, LA L896, LO L896, LY L896 - TOPLED LS T670, LO T670, LY T670, LG T670, LP T670 LSG T670, LSP T670, LSY T670, LOP T670, LYG T670 LG T671, LOG T671, LSG T671 LB T673, LV T673, LT T673, LW T673 LH T674 LS T676, LA T676, LO T676, LY T676, LB T676, LH T676, LSB T676, LW T676 LB T67C, LV T67C, LT T67C, LS T67K, LO T67K, LY T67K, LW E67C LS E67B, LA E67B, LO E67B, LY E67B, LB E67C, LV E67C, LT E67C LW T67C LS T679, LY T679, LG T679 LS T770, LO T770, LY T770, LG T770, LP T770 LB T773, LV T773, LT T773, LW T773 LH T774 LS E675, LA E675, LY E675, LS T675 LS T776, LA T776, LO T776, LY T776, LB T776 LHGB T686 LT T68C, LB T68C - Hyper Mini TOPLED® LB M676 - Mini TOPLED Santana® LG M470 LS M47K, LO M47K, LY M47K Source: http://www.osram.convergy.de LUXEON: - LUMILED® LXK2-PW12-R00, LXK2-PW12-S00, LXK2-PW14-U00, LXK2-PW14-V00 LXK2-PM12-R00, LXK2-PM12-S00, LXK2-PM14-U00 LXK2-PE12-Q00, LXK2-PE12-R00, LXK2-PE12-S00, LXK2-PE14-T00, LXK2-PE14-U00 LXK2-PB12-K00, LXK2-PB12-L00, LXK2-PB12-M00, LXK2-PB14-N00, LXK2-PB14-P00, LXK2-PB14-Q00 LXK2-PR12-L00, LXK2-PR12-M00, LXK2-PR14-Q00, LXK2-PR14-R00 LXK2-PD12-Q00, LXK2-PD12-R00, LXK2-PD12-S00 LXK2-PH12-R00, LXK2-PH12-S00 LXK2-PL12-P00, LXK2-PL12-Q00, LXK2-PL12-R00 Source: www.luxeon.com KINGBRIGHT: KA-3528ASYC Source: www.kingbright.com; R: SMD-LED 0805 GN
LED2 = led:LED: LED OSRAM: - CHIPLED LG R971, LG N971, LY N971, LG Q971, LY Q971, LO R971, LY R971 LH N974, LH R974 LS Q976, LO Q976, LY Q976 LO Q996 - Hyper CHIPLED LW Q18S LB Q993, LB Q99A, LB R99A - SideLED LS A670, LO A670, LY A670, LG A670, LP A670 LB A673, LV A673, LT A673, LW A673 LH A674 LY A675 LS A676, LA A676, LO A676, LY A676, LW A676 LS A679, LY A679, LG A679 - Hyper Micro SIDELED® LS Y876, LA Y876, LO Y876, LY Y876 LT Y87S - SmartLED LW L88C, LW L88S LB L89C, LB L89S, LG L890 LS L89K, LO L89K, LY L89K LS L896, LA L896, LO L896, LY L896 - TOPLED LS T670, LO T670, LY T670, LG T670, LP T670 LSG T670, LSP T670, LSY T670, LOP T670, LYG T670 LG T671, LOG T671, LSG T671 LB T673, LV T673, LT T673, LW T673 LH T674 LS T676, LA T676, LO T676, LY T676, LB T676, LH T676, LSB T676, LW T676 LB T67C, LV T67C, LT T67C, LS T67K, LO T67K, LY T67K, LW E67C LS E67B, LA E67B, LO E67B, LY E67B, LB E67C, LV E67C, LT E67C LW T67C LS T679, LY T679, LG T679 LS T770, LO T770, LY T770, LG T770, LP T770 LB T773, LV T773, LT T773, LW T773 LH T774 LS E675, LA E675, LY E675, LS T675 LS T776, LA T776, LO T776, LY T776, LB T776 LHGB T686 LT T68C, LB T68C - Hyper Mini TOPLED® LB M676 - Mini TOPLED Santana® LG M470 LS M47K, LO M47K, LY M47K Source: http://www.osram.convergy.de LUXEON: - LUMILED® LXK2-PW12-R00, LXK2-PW12-S00, LXK2-PW14-U00, LXK2-PW14-V00 LXK2-PM12-R00, LXK2-PM12-S00, LXK2-PM14-U00 LXK2-PE12-Q00, LXK2-PE12-R00, LXK2-PE12-S00, LXK2-PE14-T00, LXK2-PE14-U00 LXK2-PB12-K00, LXK2-PB12-L00, LXK2-PB12-M00, LXK2-PB14-N00, LXK2-PB14-P00, LXK2-PB14-Q00 LXK2-PR12-L00, LXK2-PR12-M00, LXK2-PR14-Q00, LXK2-PR14-R00 LXK2-PD12-Q00, LXK2-PD12-R00, LXK2-PD12-S00 LXK2-PH12-R00, LXK2-PH12-S00 LXK2-PL12-P00, LXK2-PL12-Q00, LXK2-PL12-R00 Source: www.luxeon.com KINGBRIGHT: KA-3528ASYC Source: www.kingbright.com; R: SLK 3MM RT
Q1 = crystal:CRYSTAL: CRYSTAL; OC_FARNELL: unknown; OC_NEWARK: unknown; R: 8,0000-HC49-SMD
Q2 Q4 Q6 Q8 Q10 Q12 = transistor-npn:BC847*: NPN Transistor; R: BC 847A SMD
Q3 Q5 Q7 Q9 Q11 Q13 = transistor-power:P-MOSFET-SO8: P-Channel MOSFET Example: FDS4435A; P-Channel Logic Level PowerTrench® MOSFET FDS4465; P-Channel 1.8V Specified PowerTrench® MOSFET Source: www.fairchildsemi.com; R: IRF 9332
R1 R39 = rcl:R-EU_: RESISTOR, European symbol; R: SMD-0805 100
R2 R9 R13 R17 R21 R26 = rcl:R-EU_: RESISTOR, European symbol; R: SMD-0805 10,0K
R3 = rcl:R-EU_: RESISTOR, European symbol; R: SPR-0805 300
R4 R10 R14 R18 R22 R25 R27 R32-R36 = rcl:R-EU_: RESISTOR, European symbol; R: SMD-0805 18,0K
R5 = pot:TRIM_EU-: POTENTIOMETER; R: 64Y-200
R6 R11 R15 R19 R23 R28 = rcl:R-EU_: RESISTOR, European symbol; R: SMD-0805 1,20K
R7 = rcl:R-EU_: RESISTOR, European symbol; R: SPR-0805 240
R8 R12 R16 R20 R24 R29 = rcl:R-EU_: RESISTOR, European symbol; R: SMD-0805 560
R30 R31 = rcl:R-EU_: RESISTOR, European symbol; R: SMD 1/4W 2,4
R37 R38 = rcl:R-EU_: RESISTOR, European symbol; R: BLM18PG 600
S1-S4 = switch-omron:10-XX: OMRON SWITCH; MPN: B3F-1000; OC_FARNELL: 176432; OC_NEWARK: 36M3542; R: TASTER 9302
SJ1 = jumper:SJ: SMD solder JUMPER
SV1 = con-lstb:MA04-2: PIN HEADER; OC_FARNELL: unknown; OC_NEWARK: unknown; R: MPE 094-2-008
SV2 = con-lstb:MA03-1: PIN HEADER; OC_FARNELL: unknown; OC_NEWARK: unknown; R: BL 1X20G7 2,54
SV3 = con-lstb:MA03-1: PIN HEADER; OC_FARNELL: unknown; OC_NEWARK: unknown
SV4 = con-lstb:MA04-1: PIN HEADER; OC_FARNELL: unknown; OC_NEWARK: unknown
SV5 = con-lstb:MA07-1: PIN HEADER; OC_FARNELL: unknown; OC_NEWARK: unknown
U$1 = stm32F:STM32F051
U$3 = extra:DUMMY_BOM; BOM: yes; R: PSK 254/3W
U$4-U$10 = extra:DUMMY_BOM; R: PSK 254/3W
U$11 = extra:DUMMY_BOM; R: EA DOGM204W-A
U$12-U$17 = extra:DUMMY_BOM; R: AKL 249-02
U$18 U$19 = extra:DUMMY_BOM; R: PSK-KONTAKTE
X1 = con-ptr500:AK500/2: CONNECTOR; OC_FARNELL: unknown; OC_NEWARK: unknown; R: AKL 101-02
X2-X7 = con-phoenix-508:MSTBA2: PHOENIX; MF: FARNELL; MPN: 1757242; OC_FARNELL: 3705171; OC_NEWARK: 71C4161; R: AKL 230-02
X8-X13 = con-phoenix-508:MSTBA2: PHOENIX; MF: FARNELL; MPN: 1757242; OC_FARNELL: 3705171; OC_NEWARK: 71C4161
X15 = con-cypressindustries:MINI-USB-SCHIELD-: MINI USB-B Conector Source: www.cypressindustries.com; OC_FARNELL: unknown; OC_NEWARK: unknown; R: USB BWM SMD

## Net classes
0 default: clearance 0.355 mm